# Altium project ESP32 + SSD1306 + External Antenna.PrjPcb
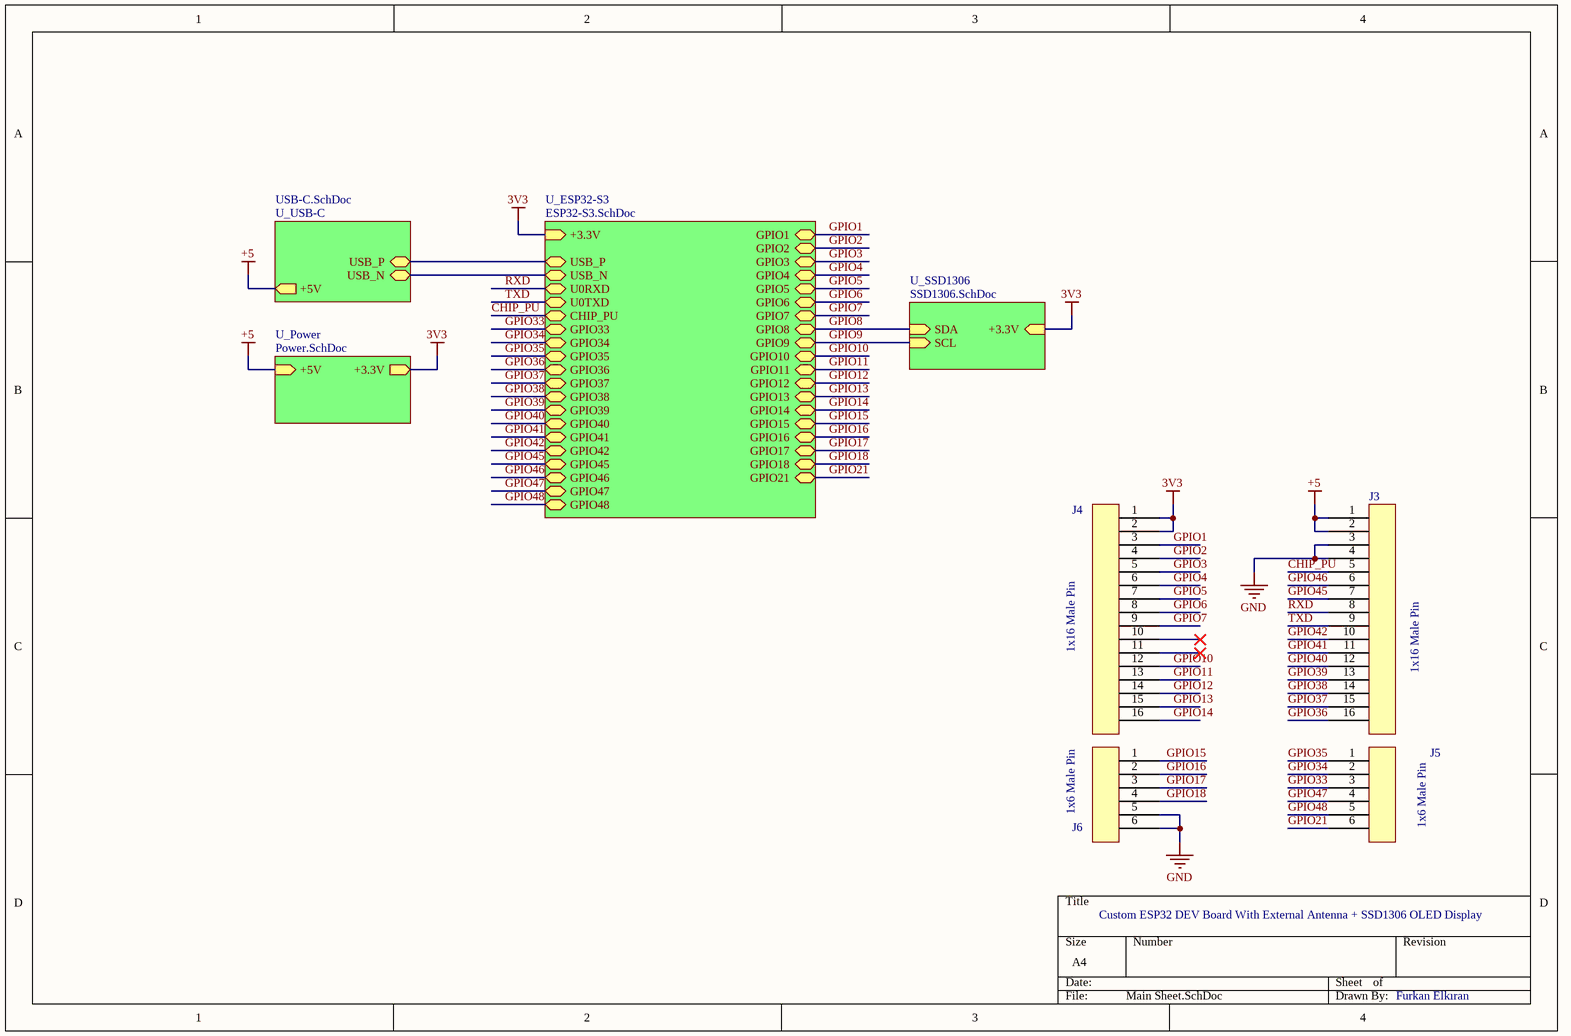
[diagram p0: Main Sheet.SchDoc]
5 sheets, 47 parts. Net scope: hierarchical (ports join the sheet entries above them; power ports are global).
Board file: PCB1.PcbDoc
Sheets:
  Main Sheet.SchDoc
    U_ESP32-S3 = ESP32-S3.SchDoc
    U_Power = Power.SchDoc
    U_USB-C = USB-C.SchDoc
    U_SSD1306 = SSD1306.SchDoc

## Sheet Main Sheet.SchDoc
size A4; SheetNumber: 1; SheetTotal: 5

### Parts
J3  1x16 Male Pin  [1x16 Male Pin]
J4  1x16 Male Pin  [1x16 Male Pin]
J5  1x6 Male Pin  [1x6 Male Pin]
J6  1x6 Male Pin  [1x6 Male Pin]

### Sub-sheets
U_ESP32-S3 = ESP32-S3.SchDoc: GPIO1 (bidir), GPIO2 (bidir), GPIO3 (bidir), GPIO4 (bidir), GPIO5 (bidir), GPIO6 (bidir), GPIO7 (bidir), GPIO8 (bidir), GPIO9 (bidir), GPIO10 (bidir), GPIO11 (bidir), GPIO12 (bidir), GPIO13 (bidir), GPIO14 (bidir), GPIO17 (bidir), GPIO18 (bidir), GPIO21 (bidir), GPIO35 (bidir), GPIO36 (bidir), GPIO37 (bidir), GPIO38 (bidir), GPIO45 (bidir), GPIO46 (bidir), USB_N (bidir), USB_P (bidir), GPIO41 (bidir), GPIO40 (bidir), GPIO39 (bidir), GPIO42 (bidir), U0TXD (bidir), U0RXD (bidir), +3.3V (in), GPIO15 (bidir), GPIO16 (bidir), GPIO47 (bidir), GPIO48 (bidir), CHIP_PU (bidir), GPIO33 (bidir), GPIO34 (bidir)
U_Power = Power.SchDoc: +5V (in), +3.3V (out)
U_SSD1306 = SSD1306.SchDoc: +3.3V (in), SCL (in), SDA (in)
U_USB-C = USB-C.SchDoc: USB_P (bidir), USB_N (bidir), +5V (out)

### Nets
3V3: J4.1 J4.2 ; sheet U_ESP32-S3/+3.3V, sheet U_Power/+3.3V, sheet U_SSD1306/+3.3V
+5: J3.1 J3.2 ; sheet U_Power/+5V, sheet U_USB-C/+5V
GND: J3.3 J3.4 J6.5 J6.6
CHIP_PU: J3.5 ; sheet U_ESP32-S3/CHIP_PU
GPIO1: J4.3 ; sheet U_ESP32-S3/GPIO1
GPIO2: J4.4 ; sheet U_ESP32-S3/GPIO2
GPIO3: J4.5 ; sheet U_ESP32-S3/GPIO3
GPIO4: J4.6 ; sheet U_ESP32-S3/GPIO4
GPIO5: J4.7 ; sheet U_ESP32-S3/GPIO5
GPIO6: J4.8 ; sheet U_ESP32-S3/GPIO6
GPIO7: J4.9 ; sheet U_ESP32-S3/GPIO7
GPIO8: sheet U_ESP32-S3/GPIO8, sheet U_SSD1306/SDA
GPIO9: sheet U_ESP32-S3/GPIO9, sheet U_SSD1306/SCL
GPIO10: J4.12 ; sheet U_ESP32-S3/GPIO10
GPIO11: J4.13 ; sheet U_ESP32-S3/GPIO11
GPIO12: J4.14 ; sheet U_ESP32-S3/GPIO12
GPIO13: J4.15 ; sheet U_ESP32-S3/GPIO13
GPIO14: J4.16 ; sheet U_ESP32-S3/GPIO14
GPIO15: J6.1 ; sheet U_ESP32-S3/GPIO15
GPIO16: J6.2 ; sheet U_ESP32-S3/GPIO16
GPIO17: J6.3 ; sheet U_ESP32-S3/GPIO17
GPIO18: J6.4 ; sheet U_ESP32-S3/GPIO18
GPIO21: J5.6 ; sheet U_ESP32-S3/GPIO21
GPIO33: J5.3 ; sheet U_ESP32-S3/GPIO33
GPIO34: J5.2 ; sheet U_ESP32-S3/GPIO34
GPIO35: J5.1 ; sheet U_ESP32-S3/GPIO35
GPIO36: J3.16 ; sheet U_ESP32-S3/GPIO36
GPIO37: J3.15 ; sheet U_ESP32-S3/GPIO37
GPIO38: J3.14 ; sheet U_ESP32-S3/GPIO38
GPIO39: J3.13 ; sheet U_ESP32-S3/GPIO39
GPIO40: J3.12 ; sheet U_ESP32-S3/GPIO40
GPIO41: J3.11 ; sheet U_ESP32-S3/GPIO41
GPIO42: J3.10 ; sheet U_ESP32-S3/GPIO42
GPIO45: J3.7 ; sheet U_ESP32-S3/GPIO45
GPIO46: J3.6 ; sheet U_ESP32-S3/GPIO46
GPIO47: J5.4 ; sheet U_ESP32-S3/GPIO47
GPIO48: J5.5 ; sheet U_ESP32-S3/GPIO48
RXD: J3.8 ; sheet U_ESP32-S3/U0RXD
TXD: J3.9 ; sheet U_ESP32-S3/U0TXD
USBO_N: sheet U_ESP32-S3/USB_N, sheet U_USB-C/USB_N
USBO_P: sheet U_ESP32-S3/USB_P, sheet U_USB-C/USB_P

Not connected (* = marked no-connect by the designer): J4 10* 11*

### Notes on the sheet
- Custom ESP32 DEV Board With External Antenna + SSD1306 OLED Display
- Furkan Elkıran

## Sheet ESP32-S3.SchDoc
size A4; SheetNumber: 2; SheetTotal: 5
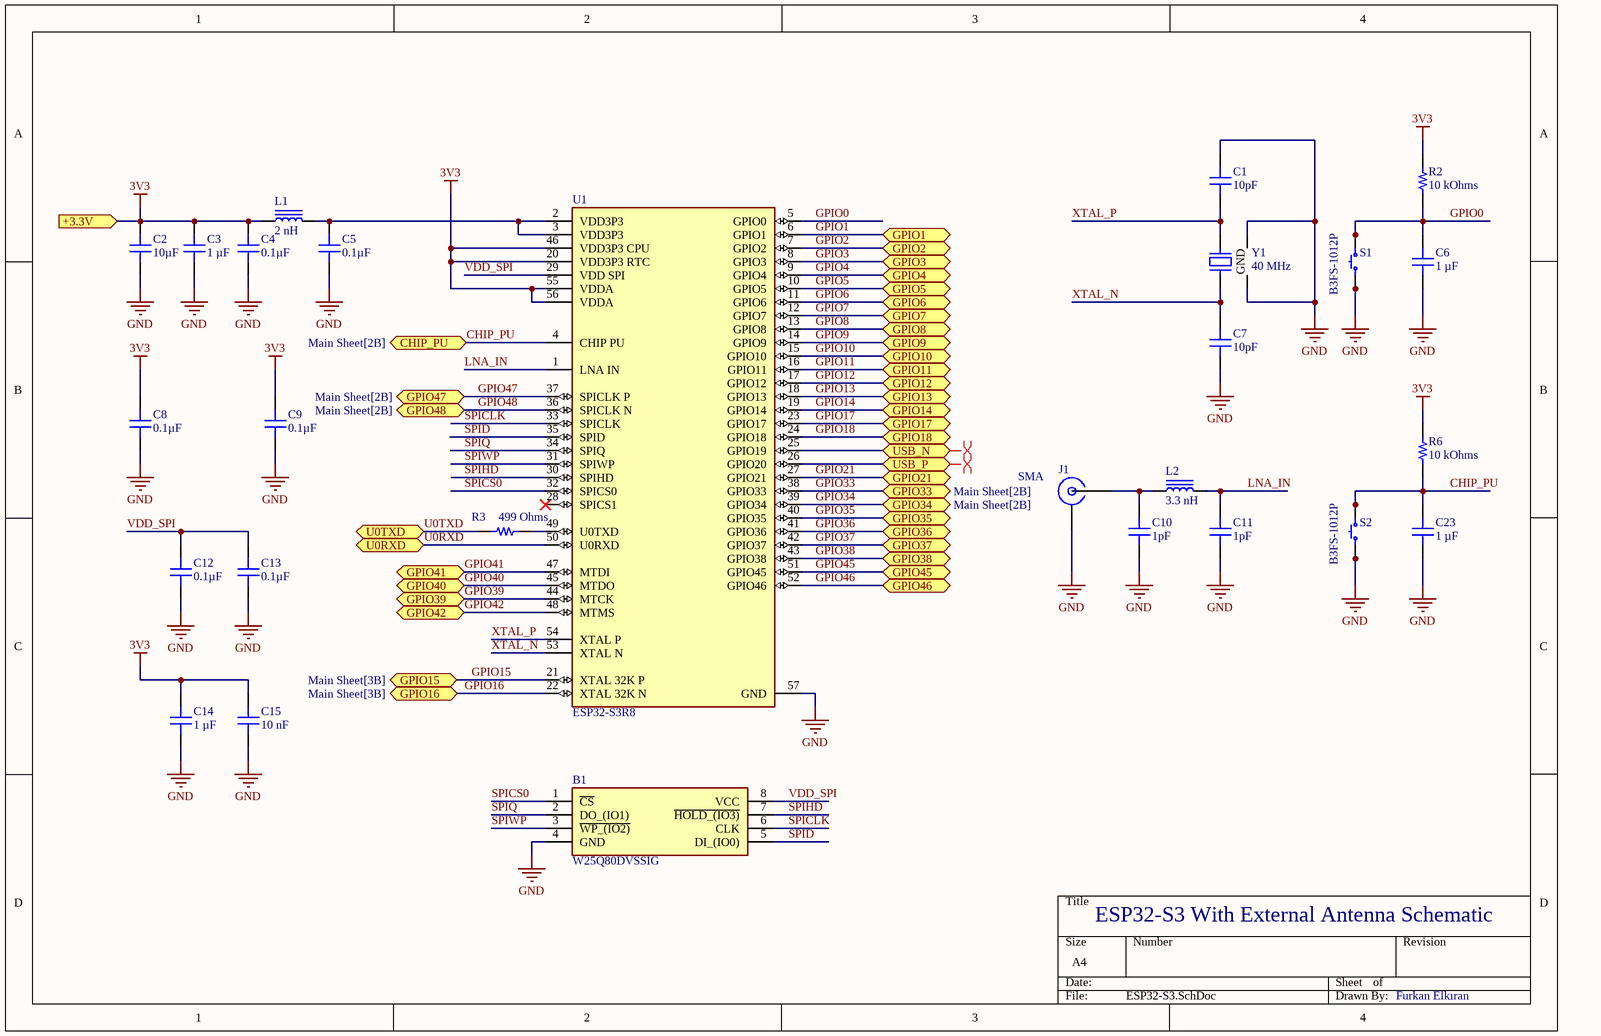
[diagram p1: ESP32-S3.SchDoc]

### Parts
B1  W25Q80DVSSIG  [SOIC127P790X216-8N]
C1  10pF  [CAP 0402_1005]
C2  10µF  [CAP 0402_1005]
C3  1 µF  [CAP 0402_1005]
C4  0.1µF  [CAP 0402_1005]
C5  0.1µF  [CAP 0402_1005]
C6  1 µF  [CAP 0402_1005]
C7  10pF  [CAP 0402_1005]
C8  0.1µF  [CAP 0402_1005]
C9  0.1µF  [CAP 0402_1005]
C10  1pF  [CAP 0402_1005]
C11  1pF  [CAP 0402_1005]
C12  0.1µF  [CAP 0402_1005]
C13  0.1µF  [CAP 0402_1005]
C14  1 µF  [CAP 0402_1005]
C15  Capacitance: 10 nF  [CAP 0402_1005]  (hidden comment: 1 µF)
C23  1 µF  [CAP 0402_1005]
J1  Connector Style: SMA  [MOLEX SD-73100-0114]  (hidden comment: 0731000114)
L1  2 nH  [IND 0402_1005]
L2  3.3 nH  [Murata LQG15 0402]
R2  10 kOhms  [RES 0402_1005]
R3  499 Ohms  [RES 0402_1005]
R6  10 kOhms  [RES 0402_1005]
S1  B3FS-1012P  [OMRON B3FS-1012P]
S2  B3FS-1012P  [OMRON B3FS-1012P]
U1  ESP32-S3R8  [FP-ESP32-S3R8-IPC_A]
Y1  40 MHz  [NDK NX3225SA]

### Ports
+3.3V (in, see Main Sheet[2A], Power[4B], SSD1306[3C]), CHIP_PU (bidir, see Main Sheet[2B]), GPIO1 (bidir, see Main Sheet[3A]), GPIO2 (bidir, see Main Sheet[3A]), GPIO3 (bidir, see Main Sheet[3B]), GPIO4 (bidir, see Main Sheet[3B]), GPIO5 (bidir, see Main Sheet[3B]), GPIO6 (bidir, see Main Sheet[3B]), GPIO7 (bidir, see Main Sheet[3B]), GPIO8 (bidir, see Main Sheet[3B]), GPIO9 (bidir, see Main Sheet[3B]), GPIO10 (bidir, see Main Sheet[3B]), GPIO11 (bidir, see Main Sheet[3B]), GPIO12 (bidir, see Main Sheet[3B]), GPIO13 (bidir, see Main Sheet[3B]), GPIO14 (bidir, see Main Sheet[3B]), GPIO15 (bidir, see Main Sheet[3B]), GPIO16 (bidir, see Main Sheet[3B]), GPIO17 (bidir, see Main Sheet[3B]), GPIO18 (bidir, see Main Sheet[3B]), GPIO21 (bidir, see Main Sheet[3B]), GPIO33 (bidir, see Main Sheet[2B]), GPIO34 (bidir, see Main Sheet[2B]), GPIO35 (bidir, see Main Sheet[2B]), GPIO36 (bidir, see Main Sheet[2B]), GPIO37 (bidir, see Main Sheet[2B]), GPIO38 (bidir, see Main Sheet[2B]), GPIO39 (bidir, see Main Sheet[2B]), GPIO40 (bidir, see Main Sheet[2B]), GPIO41 (bidir, see Main Sheet[2B]), GPIO42 (bidir, see Main Sheet[2B]), GPIO45 (bidir, see Main Sheet[2B]), GPIO46 (bidir, see Main Sheet[2B]), GPIO47 (bidir, see Main Sheet[2B]), GPIO48 (bidir, see Main Sheet[2B]), U0RXD (bidir, see Main Sheet[2B]), U0TXD (bidir, see Main Sheet[2B]), USB_N (bidir, see Main Sheet[2B], USB-C[3B]), USB_P (bidir, see Main Sheet[2B], USB-C[3B])

### Nets
3V3: C2.2 C3.2 C4.2 C8.2 C9.2 C14.2 C15.2 L1.1 R2.2 R6.2 U1.20(VDD3P3_RTC) U1.46(VDD3P3_CPU) U1.55(VDDA) U1.56(VDDA) ; port +3.3V
GND: B1.4(GND) C1.2 C2.1 C3.1 C4.1 C5.1 C6.1 C7.1 C8.1 C9.1 C10.1 C11.1 C12.1 C13.1 C14.1 C15.1 C23.1 J1.G(GND) S1.1 S1.2 S2.1 S2.2 U1.57(GND) Y1.2(GND) Y1.4(GND)
CHIP_PU: C23.2 R6.1 S2.3 S2.4 U1.4(CHIP_PU) ; port CHIP_PU
GPIO0: C6.2 R2.1 S1.3 S1.4 U1.5(GPIO0)
GPIO1: U1.6(GPIO1) ; port GPIO1
GPIO2: U1.7(GPIO2) ; port GPIO2
GPIO3: U1.8(GPIO3) ; port GPIO3
GPIO4: U1.9(GPIO4) ; port GPIO4
GPIO5: U1.10(GPIO5) ; port GPIO5
GPIO6: U1.11(GPIO6) ; port GPIO6
GPIO7: U1.12(GPIO7) ; port GPIO7
GPIO8: U1.13(GPIO8) ; port GPIO8
GPIO9: U1.14(GPIO9) ; port GPIO9
GPIO10: U1.15(GPIO10) ; port GPIO10
GPIO11: U1.16(GPIO11) ; port GPIO11
GPIO12: U1.17(GPIO12) ; port GPIO12
GPIO13: U1.18(GPIO13) ; port GPIO13
GPIO14: U1.19(GPIO14) ; port GPIO14
GPIO15: U1.21(XTAL_32K_P) ; port GPIO15
GPIO16: U1.22(XTAL_32K_N) ; port GPIO16
GPIO17: U1.23(GPIO17) ; port GPIO17
GPIO18: U1.24(GPIO18) ; port GPIO18
GPIO21: U1.27(GPIO21) ; port GPIO21
GPIO33: U1.38(GPIO33) ; port GPIO33
GPIO34: U1.39(GPIO34) ; port GPIO34
GPIO35: U1.40(GPIO35) ; port GPIO35
GPIO36: U1.41(GPIO36) ; port GPIO36
GPIO37: U1.42(GPIO37) ; port GPIO37
GPIO38: U1.43(GPIO38) ; port GPIO38
GPIO39: U1.44(MTCK) ; port GPIO39
GPIO40: U1.45(MTDO) ; port GPIO40
GPIO41: U1.47(MTDI) ; port GPIO41
GPIO42: U1.48(MTMS) ; port GPIO42
GPIO45: U1.51(GPIO45) ; port GPIO45
GPIO46: U1.52(GPIO46) ; port GPIO46
GPIO47: U1.37(SPICLK_P) ; port GPIO47
GPIO48: U1.36(SPICLK_N) ; port GPIO48
LNA_IN: C11.2 L2.2 U1.1(LNA_IN)
SPICLK: B1.6(CLK) U1.33(SPICLK)
SPICS0: B1.1(~{CS}) U1.32(SPICS0)
SPID: B1.5(DI_(IO0)) U1.35(SPID)
SPIHD: B1.7(~{HOLD_(IO3)}) U1.30(SPIHD)
SPIQ: B1.2(DO_(IO1)) U1.34(SPIQ)
SPIWP: B1.3(~{WP_(IO2)}) U1.31(SPIWP)
U0RXD: U1.50(U0RXD) ; port U0RXD  [project net RXD]
U0TXD: R3.1 ; port U0TXD  [project net TXD]
USBO_N: U1.25(GPIO19) ; port USB_N
USBO_P: U1.26(GPIO20) ; port USB_P
VDD_SPI: B1.8(VCC) C12.2 C13.2 U1.29(VDD_SPI)
XTAL_N: C7.2 U1.53(XTAL_N) Y1.1
XTAL_P: C1.1 U1.54(XTAL_P) Y1.3
NetC5_2: C5.2 L1.2 U1.2(VDD3P3) U1.3(VDD3P3)
NetC10_2: C10.2 J1.S(SIGNAL) L2.1
NetR3_2: R3.2 U1.49(U0TXD)

Not connected (* = marked no-connect by the designer): U1 28(SPICS1)*

### Layout directives
differential pair: USBO_N, USBO_P

### Notes on the sheet
- ESP32-S3 With External Antenna Schematic
- Furkan Elkıran

### Library data of the parts
B1 = W25Q80DVSSIG: 8Mb Serial NOR Flash 104MHz SOP8; Manufacturer_Name: Winbond; Geometry.Height: 2.16mm; Manufacturer_Part_Number: W25Q80DVSSIG; Mouser Part Number: 454-W25Q80DVSSIG; Mouser Price/Stock: https://www.mouser.co.uk/ProductDetail/Winbond/W25Q80DVSSIG?qs=qSfuJ%252Bfl%2Fd6z%2FQYNv5lpMA%3D%3D; Arrow Part Number: W25Q80DVSSIG; Arrow Price/Stock: https://www.arrow.com/en/products/w25q80dvssig/winbond-electronics?region=nac; Datasheet Link: https://www.winbond.com/hq/search-resource-file.jsp?partNo=W25Q80DVSSIG&type=datasheet
C1 C7 = 0402YA100KAT2A: CAP CER 10PF 16V NP0 0402; manufacturer: AVX Corporation; Temperature Coefficient: C0G, NP0; Tolerance: ±10%; Part Number: 0402YA100KAT2A; Capacitance: 10pF; Applications: General Purpose; componentlink1description: Datasheet; componentlink1url: http://datasheets.avx.com/C0GNP0-Dielectric.pdf; componentlink2description: DigiKey Link; componentlink2url: http://digikey.com/product-detail/en/avx-corporation/0402YA100KAT2A/478-12649-1-ND/9949182; Device Package: 0402 (1005 Metric); lastupdated: 8.02.2022 12:26:50; Lifecycle Status: Active; Minimum Order: 1; Mounting Type: Surface Mount, MLCC; Operating Temperature: -55°C ~ 125°C; Package / Case: 0402 (1005 Metric); packaging: TapeAndReel; partid: 7279; Part Status: Active; price: 0.01; series: -; Size / Dimension: 0.039" L x 0.020" W (1.00mm x 0.50mm); Supplier 1: DigiKey; Supplier Part Number 1: 478-12649-1-ND; Thickness (Max): 0.022" (0.56mm); value: 10pF; Voltage - Rated: 16V
C2 = 0402ZD106MAT2A: CAP CER 10UF 10V X5R 0402; manufacturer: AVX Corporation; Tolerance: ±20%; Part Number: 0402ZD106MAT2A; Capacitance: 10µF; Applications: General Purpose; componentlink1description: Datasheet; componentlink1url: http://datasheets.avx.com/cx5r.pdf; componentlink2description: DigiKey Link; componentlink2url: http://digikey.com/product-detail/en/avx-corporation/0402ZD106MAT2A/478-10052-1-ND/6564275; Device Package: 0402 (1005 Metric); lastupdated: 8.02.2022 12:26:50; Lifecycle Status: Active; Minimum Order: 1; Mounting Type: Surface Mount, MLCC; Operating Temperature: -55°C ~ 85°C; Package / Case: 0402 (1005 Metric); packaging: TapeAndReel; partid: 6854; Part Status: Active; price: 0.24; series: -; Size / Dimension: 0.039" L x 0.020" W (1.00mm x 0.50mm); Supplier 1: DigiKey; Supplier Part Number 1: 478-10052-1-ND; Temperature Coefficient: X5R; Thickness (Max): 0.028" (0.71mm); value: 10µF; Voltage - Rated: 10V
C3 C6 C14 C15 C23 = GMC04X7R105K10NT: CAP0402 X7R 1UF 10% 10V; manufacturer: Cal-Chip Electronics, Inc.; Part Number: GMC04X7R105K10NT; Applications: General Purpose; componentlink1description: Datasheet; componentlink1url: https://88ce57.p3cdn1.secureserver.net/wp-content/uploads/2023/01/gmc_series-2.pdf; componentlink2description: DigiKey Link; componentlink2url: https://www.digikey.com/en/products/detail/cal-chip-electronics-inc/GMC04X7R105K10NT/18151137; Device Package: 0402 (1005 Metric); lastupdated: 9.02.2024 20:03:57; Lifecycle Status: Active; Minimum Order: 1; Mounting Type: Surface Mount, MLCC; Operating Temperature: -55°C ~ 125°C; Package / Case: 0402 (1005 Metric); packaging: TapeAndReel; partid: 49948; Part Status: Active; price: 0.02; series: GMC; Size / Dimension: 0.039" L x 0.020" W (1.00mm x 0.50mm); Supplier 1: DigiKey; Supplier Part Number 1: 4713-GMC04X7R105K10NTCT-ND; Temperature Coefficient: X7R; Thickness (Max): 0.022" (0.55mm); Tolerance: ±10%; value: 1 µF; Voltage - Rated: 10V
  C3 C6 C14 C23: Capacitance: 1 µF
C4 C5 C8 C9 C12 C13 = 0402YD104JAT2A: CAP CER 0.1UF 16V X5R 0402; manufacturer: AVX Corporation; Tolerance: ±5%; Part Number: 0402YD104JAT2A; Capacitance: 0.1µF; Applications: General Purpose; componentlink1description: Datasheet; componentlink1url: http://datasheets.avx.com/cx5r.pdf; componentlink2description: DigiKey Link; componentlink2url: http://digikey.com/product-detail/en/avx-corporation/0402YD104JAT2A/478-11505-1-ND/8107706; Device Package: 0402 (1005 Metric); lastupdated: 8.02.2022 12:26:42; Lifecycle Status: Active; Minimum Order: 1; Mounting Type: Surface Mount, MLCC; Operating Temperature: -55°C ~ 85°C; Package / Case: 0402 (1005 Metric); packaging: TapeAndReel; partid: 11013; Part Status: Active; price: 0.15; series: -; Size / Dimension: 0.039" L x 0.020" W (1.00mm x 0.50mm); Supplier 1: DigiKey; Supplier Part Number 1: 478-11505-1-ND; Temperature Coefficient: X5R; Thickness (Max): 0.022" (0.56mm); value: 0.1µF; Voltage - Rated: 16V
C10 C11 = 04023A1R0BAT2A: CAP CER 1PF 25V NP0 0402; manufacturer: AVX Corporation; Temperature Coefficient: C0G, NP0; Tolerance: ±0.1pF; Part Number: 04023A1R0BAT2A; Capacitance: 1pF; Applications: General Purpose; componentlink1description: Datasheet; componentlink1url: http://datasheets.avx.com/C0GNP0-Dielectric.pdf; componentlink2description: DigiKey Link; componentlink2url: http://digikey.com/product-detail/en/avx-corporation/04023A1R0BAT2A/478-11739-1-ND/8573375; Device Package: 0402 (1005 Metric); lastupdated: 8.02.2022 12:26:50; Lifecycle Status: Active; Minimum Order: 1; Mounting Type: Surface Mount, MLCC; Operating Temperature: -55°C ~ 125°C; Package / Case: 0402 (1005 Metric); packaging: TapeAndReel; partid: 7016; Part Status: Active; price: 0.06; series: -; Size / Dimension: 0.039" L x 0.020" W (1.00mm x 0.50mm); Supplier 1: DigiKey; Supplier Part Number 1: 478-11739-1-ND; Thickness (Max): 0.022" (0.56mm); value: 1pF; Voltage - Rated: 25V
J1 = 0731000114: CONN SMA RCPT R/A 50 OHM PCB; Manufacturer: Molex; Connector Type: Receptacle, Female Socket; Contact Termination: Solder; Frequency - Max: 18 GHz; Impedance: 50Ohm; Number of Ports: 1; Part Number: 0731000114; ComponentLink1Description: Datasheet; ComponentLink1URL: https://www.molex.com/pdm_docs/sd/731000114_sd.pdf; ComponentLink2Description: DigiKey Link; ComponentLink2URL: https://www.digikey.com/en/products/detail/molex/0731000114/1465147; Fastening Type: Threaded; Housing Color: Gold; LastUpdated: 29.06.2022 18:00:24; Lifecycle Status: Active; Minimum Order: 1; Mounting Type: Through Hole, Right Angle; Packaging: Tray; Part Status: Active; Price: 3.19; Series: 73100; Shield Termination: Solder; Supplier 1: DigiKey; Supplier Part Number 1: WM5525-ND
L1 = MHQ1005075HA2N0STD25: FIXED IND 2.0NH 1A 50 MOHM SMD; Manufacturer: TDK Corporation; DC Resistance (DCR): 50mOhm Max; Frequency - Self Resonant: 8GHz; Inductance Frequency - Test: 100 MHz; Material - Core: Ceramic; Q @ Freq: 20 @ 250MHz; Shielding: Unshielded; Tolerance: ±0.3nH; Type: Multilayer; Part Number: MHQ1005075HA2N0STD25; ComponentLink1Description: Datasheet; ComponentLink1URL: https://product.tdk.com/system/files/dam/doc/product/inductor/inductor/smd/catalog/inductor_automotive_high-frequency_mhq1005075ha_en.pdf; ComponentLink2Description: DigiKey Link; ComponentLink2URL: https://www.digikey.com/en/products/detail/tdk-corporation/MHQ1005075HA2N0STD25/21727258; Current Rating (Amps): 1 A; Device Package: 0402 (1005 Metric); Height - Seated (Max): 0.030" (0.75mm); Inductance: 2 nH; LastUpdated: 3.06.2024 20:12:06; Lifecycle Status: Active; Minimum Order: 1; Mounting Type: Surface Mount; Operating Temperature: -55°C ~ 125°C; Package / Case: 0402 (1005 Metric); Packaging: TapeAndReel; PartId: 7450; Price: 0.07; Ratings: AEC-Q200; Series: MHQ; Size / Dimension: 0.039" L x 0.020" W (1.00mm x 0.50mm); Supplier 1: DigiKey; Supplier Part Number 1: 445-MHQ1005075HA2N0STD25CT-ND; Supplier Device Package: 0402; Value: 2 nH
L2 = LQG15HH3N3C02D: FIXED IND 3.3NH 800MA 0.125OHM; Manufacturer: Murata Electronics; DC Resistance (DCR): 125mOhm Max; Frequency - Self Resonant: 6GHz; Inductance Frequency - Test: 100 MHz; Material - Core: Air; Q @ Freq: 8 @ 100MHz; Shielding: Unshielded; Tolerance: ±0.2nH; Type: Multilayer; Part Number: LQG15HH3N3C02D; ComponentLink1Description: Datasheet; ComponentLink1URL: https://search.murata.co.jp/Ceramy/image/img/P02/JELF243B-9101.pdf; ComponentLink2Description: DigiKey Link; ComponentLink2URL: https://www.digikey.com/en/products/detail/murata-electronics/LQG15HH3N3C02D/6798466; Current Rating (Amps): 800 mA; Device Package: 0402 (1005 Metric); Height - Seated (Max): 0.022" (0.55mm); Inductance: 3.3 nH; LastUpdated: 19.07.2024 23:59:52; Lifecycle Status: Active; Minimum Order: 1; Mounting Type: Surface Mount; Operating Temperature: -55°C ~ 125°C; Package / Case: 0402 (1005 Metric); Packaging: TapeAndReel; PartId: 2999; Part Status: Active; Price: 0.05; Ratings: AEC-Q200; Series: LQG15; Size / Dimension: 0.039" L x 0.020" W (1.00mm x 0.50mm); Supplier 1: DigiKey; Supplier Part Number 1: 490-15041-1-ND; Supplier Device Package: 0402 (1005 Metric); Value: 3.3 nH
R2 R6 = MCS0402MC1002FE000: RES SMD 10K OHM 1% 1/10W 0402; Manufacturer: Vishay Beyschlag; Power (Watts): 0.1W, 1/10W; Temperature Coefficient: ±50ppm/°C; Part Number: MCS0402MC1002FE000; Value: 10 kOhms; ComponentLink1Description: Datasheet; ComponentLink1URL: http://www.vishay.com/docs/28760/mcat_pro.pdf; ComponentLink2Description: DigiKey Link; ComponentLink2URL: http://digikey.com/product-detail/en/vishay-beyschlag/MCS0402MC1002FE000/MCS0402-10.0K-MFCT-ND/3883092; Composition: Thin Film; Device Package: 0402 (1005 Metric); Features: Anti-Sulfur, Automotive AEC-Q200; Height - Seated (Max): 0.015" (0.37mm); LastUpdated: 9.02.2024 20:30:21; Lifecycle Status: Active; Minimum Order: 1; Number of Terminations: 2; Operating Temperature: -55°C ~ 175°C; Package / Case: 0402 (1005 Metric); Packaging: TapeAndReel; PartId: 3152; Part Status: Active; Price: 0.03; Ratings: AEC-Q200; Resistance: 10 kOhms; Series: MCS AT - Professional; Size / Dimension: 0.039" L x 0.020" W (1.00mm x 0.50mm); Supplier 1: DigiKey; Supplier Part Number 1: MCS0402-10.0K-MFCT-ND; Supplier Device Package: 0402; Tolerance: ±1%
R3 = RMCF0402FT499R: RES 499 OHM 1% 1/16W 0402; Manufacturer: Stackpole Electronics Inc; Power (Watts): 0.063W, 1/16W; Temperature Coefficient: ±100ppm/°C; Part Number: RMCF0402FT499R; Value: 499 Ohms; ComponentLink1Description: Datasheet; ComponentLink1URL: https://www.seielect.com/catalog/sei-rmcf_rmcp.pdf; ComponentLink2Description: DigiKey Link; ComponentLink2URL: https://www.digikey.com/en/products/detail/stackpole-electronics-inc/RMCF0402FT499R/1714756; Composition: Thick Film; Device Package: 0402 (1005 Metric); Features: Automotive AEC-Q200; Height - Seated (Max): 0.016" (0.40mm); LastUpdated: 9.02.2024 20:30:13; Lifecycle Status: Active; Minimum Order: 1; Number of Terminations: 2; Operating Temperature: -55°C ~ 155°C; Package / Case: 0402 (1005 Metric); Packaging: CutTape; PartId: 4940; Part Status: Active; Price: 0.01; Ratings: AEC-Q200; Resistance: 499 Ohms; Series: RMCF; Size / Dimension: 0.039" L x 0.020" W (1.00mm x 0.50mm); Supplier 1: DigiKey; Supplier Part Number 1: RMCF0402FT499RCT-ND; Supplier Device Package: 0402; Tolerance: ±1%
S1 S2 = B3FS-1012P: SWITCH TACTILE SPST-NO 0.05A 24V; Manufacturer: Omron Electronics Inc-EMC Div; Actuator Height off PCB, Vertical: 4.30mm; Actuator Orientation: Top Actuated; Actuator Type: Standard; Contact Rating @ Voltage: 0.05A @ 24VDC; Illumination: Non-Illuminated; Operating Force: 150gf; Outline: 6.30mm x 6.00mm; Switch Function: Off-Mom; Part Number: B3FS-1012P; Circuit: SPST-NO; ComponentLink1Description: Datasheet; ComponentLink1URL: https://omronfs.omron.com/en_US/ecb/products/pdf/en-b3fs.pdf; ComponentLink2Description: DigiKey Link; ComponentLink2URL: http://digikey.com/product-detail/en/omron-electronics-inc-emc-div/B3FS-1012P/SW1237CT-ND/2747253; LastUpdated: 30.03.2020 15:12:46; Lifecycle Status: Active; Minimum Order: 1; Mounting Type: Surface Mount; Operating Temperature: -25°C ~ 70°C; Packaging: TapeAndReel; Part Status: Active; Price: 0.35; Series: B3FS; Supplier 1: DigiKey; Supplier Part Number 1: SW1237CT-ND; Termination Style: Gull Wing
U1 = CMP-10700-118292493-1: ESP32-S3R8 RF System on a Chip - SoC SMD IC, Dual-Core MCU, Wi-Fi 2.4G BLE 5.0 Combo; NexarPartId: 118292493
Y1 = NX3225SA-40M-EXS00A-CS03880: CRYSTAL 40.0000MHZ 10PF SMD; Manufacturer: NDK America, Inc.; ESR (Equivalent Series Resistance): 50 Ohms; Frequency Stability: ±17ppm; Frequency Tolerance: ±10ppm; Operating Mode: Fundamental; Part Number: NX3225SA-40M-EXS00A-CS03880; ComponentLink1Description: Datasheet; ComponentLink1URL: //media.digikey.com/pdf/Data%20Sheets/NDK%20PDFs/NX3225SA-40M-EXS00A-CS03880.pdf; ComponentLink2Description: DigiKey Link; ComponentLink2URL: https://www.digikey.com/en/products/detail/ndk-america-inc/NX3225SA-40M-EXS00A-CS03880/5015625; Frequency: 40 MHz; Height - Seated (Max): 0.024" (0.60mm); LastUpdated: 3.06.2024 20:02:21; Lifecycle Status: Active; Load Capacitance: 10pF; Minimum Order: 1; Mounting Type: Surface Mount; Operating Temperature: -40°C ~ 85°C; Package / Case: 4-SMD, No Lead; Packaging: TapeAndReel; PartId: 586; Part Status: Active; Price: 0.36; Series: NX3225SA; Size / Dimension: 0.126" L x 0.098" W (3.20mm x 2.50mm); Supplier 1: DigiKey; Supplier Part Number 1: 644-1249-1-ND; Type: MHz Crystal; Value: 40 MHz

## Sheet Power.SchDoc
size A4; SheetNumber: 5; SheetTotal: 5
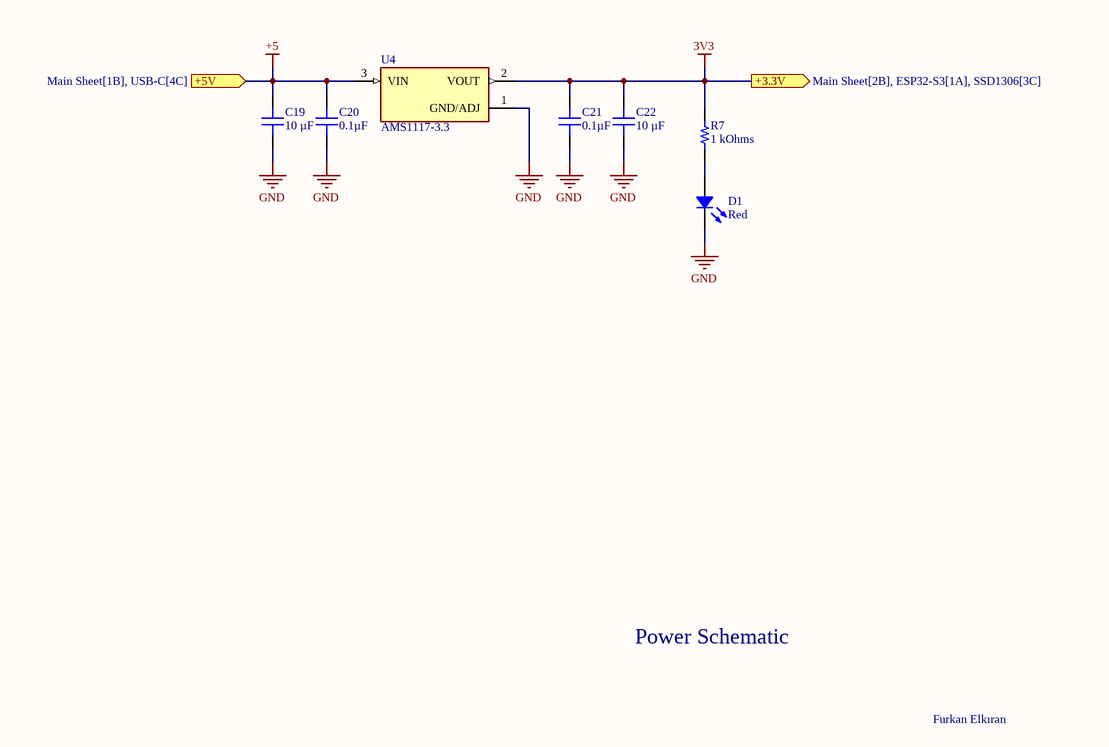
[diagram p2: Power.SchDoc]

### Parts
C19  10 µF  [CAP 0805_2012]
C20  0.1µF  [CAP 0805_2012]
C21  0.1µF  [CAP 0805_2012]
C22  10 µF  [CAP 0805_2012]
D1  Red  [LED 0603_1608 RED]
R7  1 kOhms  [RES 0402_1005]
U4  AMS1117-3.3  [SOT229P700X180-4N]

### Ports
+3.3V (out, see Main Sheet[2B], ESP32-S3[1A], SSD1306[3C]), +5V (in, see Main Sheet[1B], USB-C[4C])

### Nets
3V3: C21.2 C22.2 R7.2 U4.2(VOUT) ; port +3.3V
+5: C19.2 C20.2 U4.3(VIN) ; port +5V
GND: C19.1 C20.1 C21.1 C22.1 D1.2 U4.1(GND/ADJ)
NetD1_1: D1.1 R7.1

### Notes on the sheet
- Power Schematic
- Furkan Elkıran

### Library data of the parts
C19 C22 = CL21X106KAYNNNE: CAP CER 10UF 25V X6S 0805; manufacturer: Samsung Electro-Mechanics; Tolerance: ±10%; Part Number: CL21X106KAYNNNE; Capacitance: 10 µF; Applications: General Purpose; componentlink1description: Datasheet; componentlink1url: http://www.samsungsem.com/kr/support/product-search/mlcc/CL21X106KAYNNNE.jsp; componentlink2description: DigiKey Link; componentlink2url: https://www.digikey.com/en/products/detail/samsung-electro-mechanics/CL21X106KAYNNNE/5961182; Device Package: 0805 (2012 Metric); lastupdated: 9.02.2024 20:16:03; Lifecycle Status: Active; Minimum Order: 1; Mounting Type: Surface Mount, MLCC; Operating Temperature: -55°C ~ 105°C; Package / Case: 0805 (2012 Metric); packaging: TapeAndReel; partid: 4781; Part Status: Active; price: 0.04; series: CL; Size / Dimension: 0.079" L x 0.049" W (2.00mm x 1.25mm); Supplier 1: DigiKey; Supplier Part Number 1: 1276-6698-1-ND; Temperature Coefficient: X6S; Thickness (Max): 0.057" (1.45mm); value: 10 µF; Voltage - Rated: 25V
C20 C21 = LD055C104KAB2A: CAP CER 0.1UF 50V X7R 0805; manufacturer: AVX Corporation; Tolerance: ±10%; Part Number: LD055C104KAB2A; Capacitance: 0.1µF; Applications: General Purpose; componentlink1description: Datasheet; componentlink1url: http://datasheets.avx.com/LD-Series.pdf; componentlink2description: DigiKey Link; componentlink2url: http://digikey.com/product-detail/en/avx-corporation/LD055C104KAB2A/478-4931-1-ND/1858877; Device Package: 0805 (2012 Metric); lastupdated: 2.09.2020 01:04:40; Lifecycle Status: Active; Minimum Order: 1; Mounting Type: Surface Mount, MLCC; Operating Temperature: -55°C ~ 125°C; Package / Case: 0805 (2012 Metric); packaging: TapeAndReel; partid: 3356; Part Status: Active; price: 0.16; series: LD; Size / Dimension: 0.079" L x 0.049" W (2.01mm x 1.25mm); Supplier 1: DigiKey; Supplier Part Number 1: 478-4931-1-ND; Temperature Coefficient: X7R; Thickness (Max): 0.037" (0.94mm); value: 0.1µF; Voltage - Rated: 50V
D1 = QBLP601-R1: 0603 LED RED 623NM DOMINANT, 628; Manufacturer: QT Brightek (QTB); Configuration: Standard; Current - Test: 20mA; Lens Color: Colorless; Lens Size: 1.10mm x 0.80mm; Lens Style: Rectangle with Flat Top; Lens Transparency: Clear; Millicandela Rating: 9mcd; Viewing Angle: 140°; Voltage - Forward (Vf) (Typ): 2V; Wavelength - Peak: 628nm; Part Number: QBLP601-R1; Color: Red; ComponentLink1Description: Datasheet; ComponentLink1URL: https://www.qt-brightek.com/datasheet/QBLP601-R1.pdf; ComponentLink2Description: DigiKey Link; ComponentLink2URL: https://www.digikey.com/en/products/detail/qt-brightek-qtb/QBLP601-R1/22106643; Device Package: 0603 (1608 Metric); Height (Max): 0.70mm; LastUpdated: 3.06.2024 19:59:37; Lifecycle Status: Active; Minimum Order: 1; Mounting Type: Surface Mount; Package / Case: 0603 (1608 Metric); Packaging: TapeAndReel; PartId: 1462; Price: 0.06; Series: QBLP601; Size / Dimension: 1.60mm L x 0.80mm W; Supplier 1: DigiKey; Supplier Part Number 1: 1516-QBLP601-R1CT-ND; Supplier Device Package: 0603; Value: Red; Wavelength - Dominant: 623nm
R7 = CRCW04021K00JNEDHP: RES SMD 1K OHM 5% 1/5W 0402; Manufacturer: Vishay Dale; Power (Watts): 0.2W, 1/5W; Temperature Coefficient: ±200ppm/°C; Part Number: CRCW04021K00JNEDHP; Value: 1 kOhms; ComponentLink1Description: Datasheet; ComponentLink1URL: http://www.vishay.com/docs/20043/crcwhpe3.pdf; ComponentLink2Description: DigiKey Link; ComponentLink2URL: https://www.digikey.com/en/products/detail/vishay-dale/CRCW04021K00JNEDHP/2222560; Composition: Thick Film; Device Package: 0402 (1005 Metric); Features: Automotive AEC-Q200, Pulse Withstanding; Height - Seated (Max): 0.016" (0.40mm); LastUpdated: 9.02.2024 20:30:06; Lifecycle Status: Active; Minimum Order: 1; Number of Terminations: 2; Operating Temperature: -55°C ~ 155°C; Package / Case: 0402 (1005 Metric); Packaging: TapeAndReel; PartId: 6693; Part Status: Active; Price: 0.01; Ratings: AEC-Q200; Resistance: 1 kOhms; Series: CRCW-HP; Size / Dimension: 0.039" L x 0.020" W (1.00mm x 0.50mm); Supplier 1: DigiKey; Supplier Part Number 1: 541-1.0KYACT-ND; Supplier Device Package: 0402; Tolerance: ±5%
U4 = AMS1117-3.3: Sot223/Pkg 1-Amp 3.3-Volt Low Drop Out Voltage Regulatator; MF: Advanced Monolithic Systems; SnapEDA_Link: https://www.snapeda.com/parts/AMS1117-3.3/Advanced+Monolithic+Systems/view-part/?ref=snap; Package: SOT-223 Seeed Technology; Value: *; MP: AMS1117-3.3; Check_prices: https://www.snapeda.com/parts/AMS1117-3.3/Advanced+Monolithic+Systems/view-part/?ref=eda

## Sheet USB-C.SchDoc
size A4; SheetNumber: 4; SheetTotal: 5
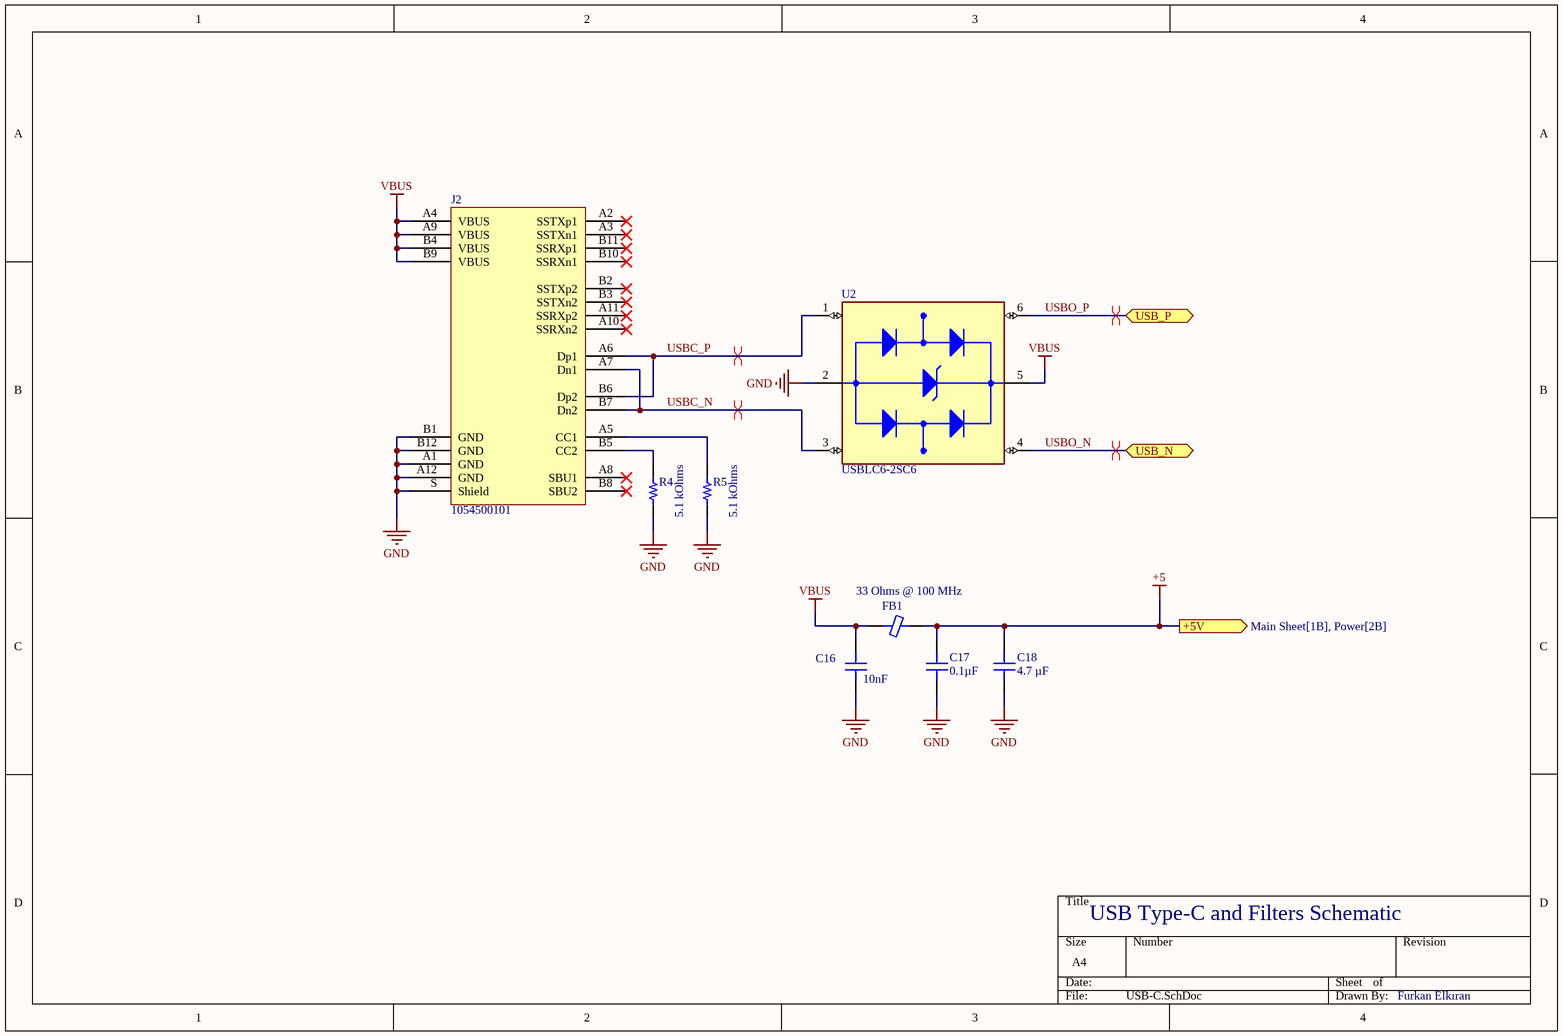
[diagram p3: USB-C.SchDoc]

### Parts
C16  Capacitance: 10nF  [CAP 0402_1005]  (hidden comment: 10000pF)
C17  0.1µF  [CAP 0402_1005]
C18  4.7 µF  [CAP 0805_2012]
FB1  33 Ohms @ 100 MHz  [FER 0402_1005]
J2  1054500101  [Molex 1054500101]
R4  5.1 kOhms  [YAGEO RES 0402_1005]
R5  5.1 kOhms  [YAGEO RES 0402_1005]
U2  USBLC6-2SC6  [SOT95P280X145-6N]

### Ports
+5V (out, see Main Sheet[1B], Power[2B]), USB_N (bidir, see Main Sheet[2B], ESP32-S3[3B]), USB_P (bidir, see Main Sheet[2B], ESP32-S3[3B])

### Nets
+5: C17.2 C18.2 FB1.2 ; port +5V
GND: C16.1 C17.1 C18.1 J2.A1(GND) J2.A12(GND) J2.B1(GND) J2.B12(GND) J2.S(Shield) R4.1 R5.1 U2.2(GND)
VBUS: C16.2 FB1.1 J2.A4(VBUS) J2.A9(VBUS) J2.B4(VBUS) J2.B9(VBUS) U2.5(VBUS)
USBC_N: J2.A7(Dn1) J2.B7(Dn2) U2.3(I/O2_IN)
USBC_P: J2.A6(Dp1) J2.B6(Dp2) U2.1(I/O1_IN)
USBO_N: U2.4(I/O2_OUT) ; port USB_N
USBO_P: U2.6(I/O1_OUT) ; port USB_P
NetJ2_A5: J2.A5(CC1) R5.2
NetJ2_B5: J2.B5(CC2) R4.2

Not connected (* = marked no-connect by the designer): J2 A2(SSTXp1)* A3(SSTXn1)* A8(SBU1)* A10(SSRXn2)* A11(SSRXp2)* B2(SSTXp2)* B3(SSTXn2)* B8(SBU2)* B10(SSRXn1)* B11(SSRXp1)*

### Layout directives
differential pair: USBC_N, USBC_P, USBO_N, USBO_P

### Notes on the sheet
- USB Type-C and Filters Schematic
- Furkan Elkıran

### Library data of the parts
C16 = 0402YC103JAT4A: CAP CER 10000PF 16V X7R 0402; manufacturer: AVX Corporation; Tolerance: ±5%; Part Number: 0402YC103JAT4A; Applications: General Purpose; componentlink1description: Datasheet; componentlink1url: http://datasheets.avx.com/X7RDielectric.pdf; componentlink2description: DigiKey Link; componentlink2url: http://digikey.com/product-detail/en/avx-corporation/0402YC103JAT4A/478-12448-1-ND/9749300; Device Package: 0402 (1005 Metric); lastupdated: 8.02.2022 12:26:50; Lifecycle Status: Active; Minimum Order: 1; Mounting Type: Surface Mount, MLCC; Operating Temperature: -55°C ~ 125°C; Package / Case: 0402 (1005 Metric); packaging: TapeAndReel; partid: 6953; Part Status: Active; price: 0.06; series: -; Size / Dimension: 0.039" L x 0.020" W (1.00mm x 0.50mm); Supplier 1: DigiKey; Supplier Part Number 1: 478-12448-1-ND; Temperature Coefficient: X7R; Thickness (Max): 0.022" (0.56mm); value: 10000pF; Voltage - Rated: 16V
C17 = 0402YC104JAT4A: CAP CER 0.1UF 16V X7R 0402; manufacturer: AVX Corporation; Tolerance: ±5%; Part Number: 0402YC104JAT4A; Capacitance: 0.1µF; Applications: General Purpose; componentlink1description: Datasheet; componentlink1url: http://datasheets.avx.com/X7RDielectric.pdf; componentlink2description: DigiKey Link; componentlink2url: http://digikey.com/product-detail/en/avx-corporation/0402YC104JAT4A/478-11502-1-ND/8107703; Device Package: 0402 (1005 Metric); lastupdated: 8.02.2022 12:26:57; Lifecycle Status: Active; Minimum Order: 1; Mounting Type: Surface Mount, MLCC; Operating Temperature: -55°C ~ 125°C; Package / Case: 0402 (1005 Metric); packaging: CutTape; partid: 2382; Part Status: Active; price: 0.10; series: -; Size / Dimension: 0.039" L x 0.020" W (1.00mm x 0.50mm); Supplier 1: DigiKey; Supplier Part Number 1: 478-11502-1-ND; Temperature Coefficient: X7R; Thickness (Max): 0.022" (0.56mm); value: 0.1µF; Voltage - Rated: 16V
C18 = C0805C475J4RACAUTO: CAP CER 4.7UF 16V X7R 0805; manufacturer: KEMET; Tolerance: ±5%; Part Number: C0805C475J4RACAUTO; Capacitance: 4.7 µF; Applications: Automotive, Bypass, Decoupling; componentlink1description: Datasheet; componentlink1url: https://api.kemet.com/component-edge/download/datasheet/C0805C475J4RACAUTO.pdf; componentlink2description: DigiKey Link; componentlink2url: https://www.digikey.com/en/products/detail/kemet/C0805C475J4RACAUTO/7427546; Device Package: 0805 (2012 Metric); lastupdated: 9.02.2024 20:15:37; Lifecycle Status: Active; Minimum Order: 1; Mounting Type: Surface Mount, MLCC; Operating Temperature: -55°C ~ 125°C; Package / Case: 0805 (2012 Metric); packaging: TapeAndReel; partid: 39263; Part Status: Active; price: 0.12; Ratings: AEC-Q200; series: SMD Auto X7R; Size / Dimension: 0.079" L x 0.049" W (2.00mm x 1.25mm); Supplier 1: DigiKey; Supplier Part Number 1: 399-15716-1-ND; Temperature Coefficient: X7R; Thickness (Max): 0.055" (1.40mm); value: 4.7 µF; Voltage - Rated: 16V
FB1 = FB100505T-330Y-S: FBEAD 0402 33 OHM .40DC 300MA; Manufacturer: Cal-Chip Electronics, Inc.; DC Resistance (DCR) (Max): 400mOhm; Filter Type: Signal Line; Number of Lines: 1; Part Number: FB100505T-330Y-S; ComponentLink1Description: Datasheet; ComponentLink1URL: https://calchip.com/wp-content/uploads/2023/05/fb_series.pdf; ComponentLink2Description: DigiKey Link; ComponentLink2URL: https://www.digikey.com/en/products/detail/cal-chip-electronics-inc/FB100505T-330Y-S/22463427; Current Rating (Max): 300mA; Device Package: 0402 (1005 Metric); Height (Max): 0.024" (0.60mm); Impedance @ Frequency: 33 Ohms @ 100 MHz; LastUpdated: 3.06.2024 19:50:49; Lifecycle Status: Active; Minimum Order: 1; Mounting Type: Surface Mount; Operating Temperature: -55°C ~ 125°C; Package / Case: 0402 (1005 Metric); Packaging: TapeAndReel; PartId: 3685; Price: 0.02; Series: FB; Size / Dimension: 0.039" L x 0.020" W (1.00mm x 0.50mm); Supplier 1: DigiKey; Supplier Part Number 1: 4713-FB100505T-330Y-SCT-ND; Value: 33 Ohms @ 100 MHz
J2 = 1054500101: CONN RCP USB3.1 TYPEC 24P SMD RA; Manufacturer: Molex; Connector Type: USB - C (Type - C); Current Rating (Amps): 0.25A, 1A, 5A; Gender: Receptacle; Mating Cycles: 10000; Number of Contacts: 24; Number of Ports: 1; Shielding: Shielded; Specifications: USB 3.1 (USB 3.1 Gen 2, Superspeed+); Voltage - Rated: 30VAC/DC; Part Number: 1054500101; ComponentLink1Description: Datasheet; ComponentLink1URL: https://www.molex.com/pdm_docs/ps/PS-105448-001.pdf; ComponentLink2Description: DigiKey Link; ComponentLink2URL: http://digikey.com/product-detail/en/molex/1054500101/WM12856CT-ND/5843891; LastUpdated: 6.06.2020 02:14:04; Lifecycle Status: Active; Minimum Order: 1; Mounting Feature: Horizontal; Mounting Type: Surface Mount, Right Angle; Through Hole; Operating Temperature: -30°C ~ 85°C; Packaging: TapeAndReel; Part Status: Active; Price: 1.22; Series: 105445; Supplier 1: DigiKey; Supplier Part Number 1: WM12856CT-ND; Termination: Solder
R4 R5 = AC0402JR-075K1L: RES SMD 5.1K OHM 5% 1/16W 0402; Manufacturer: Yageo; Power (Watts): 0.063W, 1/16W; Temperature Coefficient: ±100ppm/°C; Part Number: AC0402JR-075K1L; Value: 5.1 kOhms; ComponentLink1Description: Datasheet; ComponentLink1URL: https://www.yageo.com/upload/media/product/productsearch/datasheet/rchip/PYu-AC_51_RoHS_L_7.pdf; ComponentLink2Description: DigiKey Link; ComponentLink2URL: https://www.digikey.com/en/products/detail/yageo/AC0402JR-075K1L/5895695; Composition: Thick Film; Device Package: 0402 (1005 Metric); Features: Automotive AEC-Q200, Moisture Resistant; Height - Seated (Max): 0.015" (0.37mm); LastUpdated: 31.08.2025 15:04:16; Lifecycle Status: Active; Minimum Order: 1; Number of Terminations: 2; Operating Temperature: -55°C ~ 155°C; Package / Case: 0402 (1005 Metric); Packaging: CutTape; PartId: 4690; Part Status: Active; Price: 0.01; Ratings: AEC-Q200; Resistance: 5.1 kOhms; Series: AC; Size / Dimension: 0.039" L x 0.020" W (1.00mm x 0.50mm); Supplier 1: DigiKey; Supplier Part Number 1: YAG3554CT-ND; Supplier Device Package: 0402; Tolerance: ±5%
U2 = USBLC6-2SC6: 17V Clamp 5A (8/20Âµs) Ipp Tvs Diode Surface Mount SOT-23-6; MF: STMicroelectronics; Value: *; SnapEDA_Link: https://www.snapeda.com/parts/USBLC6-2SC6/STMicroelectronics/view-part/?ref=snap; Check_prices: https://www.snapeda.com/parts/USBLC6-2SC6/STMicroelectronics/view-part/?ref=eda; Purchase-URL: https://pricing.snapeda.com/search/part/USBLC6-2SC6/?ref=eda; Price: None; Availability: In Stock; Package: SOT-23-6 STMicroelectronics; MP: USBLC6-2SC6

## Sheet SSD1306.SchDoc
size A4; SheetNumber: 3; SheetTotal: 5
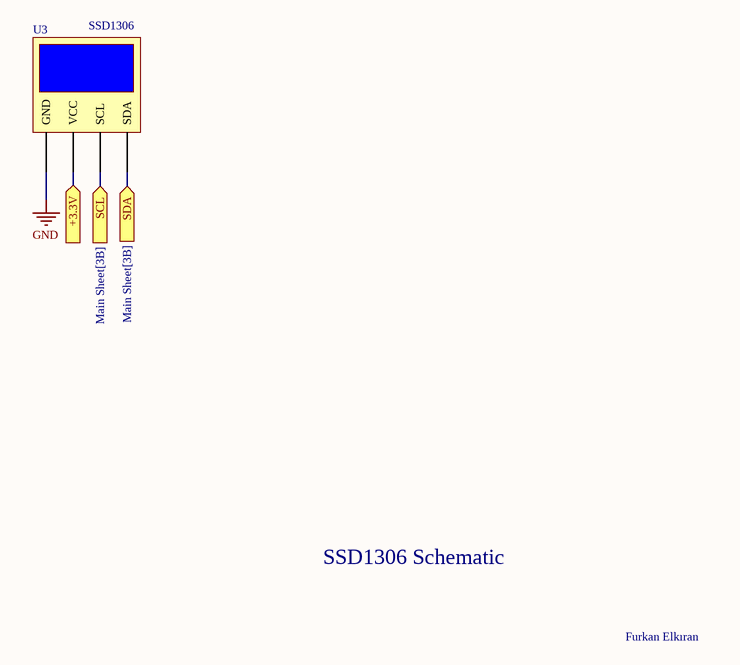
[diagram p4: SSD1306.SchDoc]

### Parts
U3  SSD1306  [SSD1306]

### Ports
+3.3V (in, see Main Sheet[3B], ESP32-S3[1A], Power[4B]), SCL (in, see Main Sheet[3B]), SDA (in, see Main Sheet[3B])

### Nets
3V3: U3.1(VCC) ; port +3.3V
GND: U3.0(GND)
GPIO8: U3.3(SDA) ; port SDA
GPIO9: U3.2(SCL) ; port SCL

### Notes on the sheet
- SSD1306 Schematic
- Furkan Elkıran

### Library data of the parts
U3 = SSD1306: SSD1306 128x64 0.96 inch OLED Display

## Nets that join several sheets
3V3: Main Sheet (J4.1 J4.2), ESP32-S3 (14 pins), Power (C21.2 C22.2 R7.2 U4.2), SSD1306 (U3.1)
+5: Main Sheet (J3.1 J3.2), Power (C19.2 C20.2 U4.3), USB-C (C17.2 C18.2 FB1.2)
GND: Main Sheet (J3.3 J3.4 J6.5 J6.6), ESP32-S3 (25 pins), Power (6 pins), USB-C (11 pins), SSD1306 (U3.0)
CHIP_PU: Main Sheet (J3.5), ESP32-S3 (5 pins)
GPIO1: Main Sheet (J4.3), ESP32-S3 (U1.6)
GPIO2: Main Sheet (J4.4), ESP32-S3 (U1.7)
GPIO3: Main Sheet (J4.5), ESP32-S3 (U1.8)
GPIO4: Main Sheet (J4.6), ESP32-S3 (U1.9)
GPIO5: Main Sheet (J4.7), ESP32-S3 (U1.10)
GPIO6: Main Sheet (J4.8), ESP32-S3 (U1.11)
GPIO7: Main Sheet (J4.9), ESP32-S3 (U1.12)
GPIO8: ESP32-S3 (U1.13), SSD1306 (U3.3)
GPIO9: ESP32-S3 (U1.14), SSD1306 (U3.2)
GPIO10: Main Sheet (J4.12), ESP32-S3 (U1.15)
GPIO11: Main Sheet (J4.13), ESP32-S3 (U1.16)
GPIO12: Main Sheet (J4.14), ESP32-S3 (U1.17)
GPIO13: Main Sheet (J4.15), ESP32-S3 (U1.18)
GPIO14: Main Sheet (J4.16), ESP32-S3 (U1.19)
GPIO15: Main Sheet (J6.1), ESP32-S3 (U1.21)
GPIO16: Main Sheet (J6.2), ESP32-S3 (U1.22)
GPIO17: Main Sheet (J6.3), ESP32-S3 (U1.23)
GPIO18: Main Sheet (J6.4), ESP32-S3 (U1.24)
GPIO21: Main Sheet (J5.6), ESP32-S3 (U1.27)
GPIO33: Main Sheet (J5.3), ESP32-S3 (U1.38)
GPIO34: Main Sheet (J5.2), ESP32-S3 (U1.39)
GPIO35: Main Sheet (J5.1), ESP32-S3 (U1.40)
GPIO36: Main Sheet (J3.16), ESP32-S3 (U1.41)
GPIO37: Main Sheet (J3.15), ESP32-S3 (U1.42)
GPIO38: Main Sheet (J3.14), ESP32-S3 (U1.43)
GPIO39: Main Sheet (J3.13), ESP32-S3 (U1.44)
GPIO40: Main Sheet (J3.12), ESP32-S3 (U1.45)
GPIO41: Main Sheet (J3.11), ESP32-S3 (U1.47)
GPIO42: Main Sheet (J3.10), ESP32-S3 (U1.48)
GPIO45: Main Sheet (J3.7), ESP32-S3 (U1.51)
GPIO46: Main Sheet (J3.6), ESP32-S3 (U1.52)
GPIO47: Main Sheet (J5.4), ESP32-S3 (U1.37)
GPIO48: Main Sheet (J5.5), ESP32-S3 (U1.36)
RXD: Main Sheet (J3.8), ESP32-S3 (U1.50)
TXD: Main Sheet (J3.9), ESP32-S3 (R3.1)
USBO_N: ESP32-S3 (U1.25), USB-C (U2.4)
USBO_P: ESP32-S3 (U1.26), USB-C (U2.6)